# Altium schematic sheet YTN1-E608(Main)V1.4显示板..schdoc
size A3; SheetNumber: 0; SheetTotal: 0
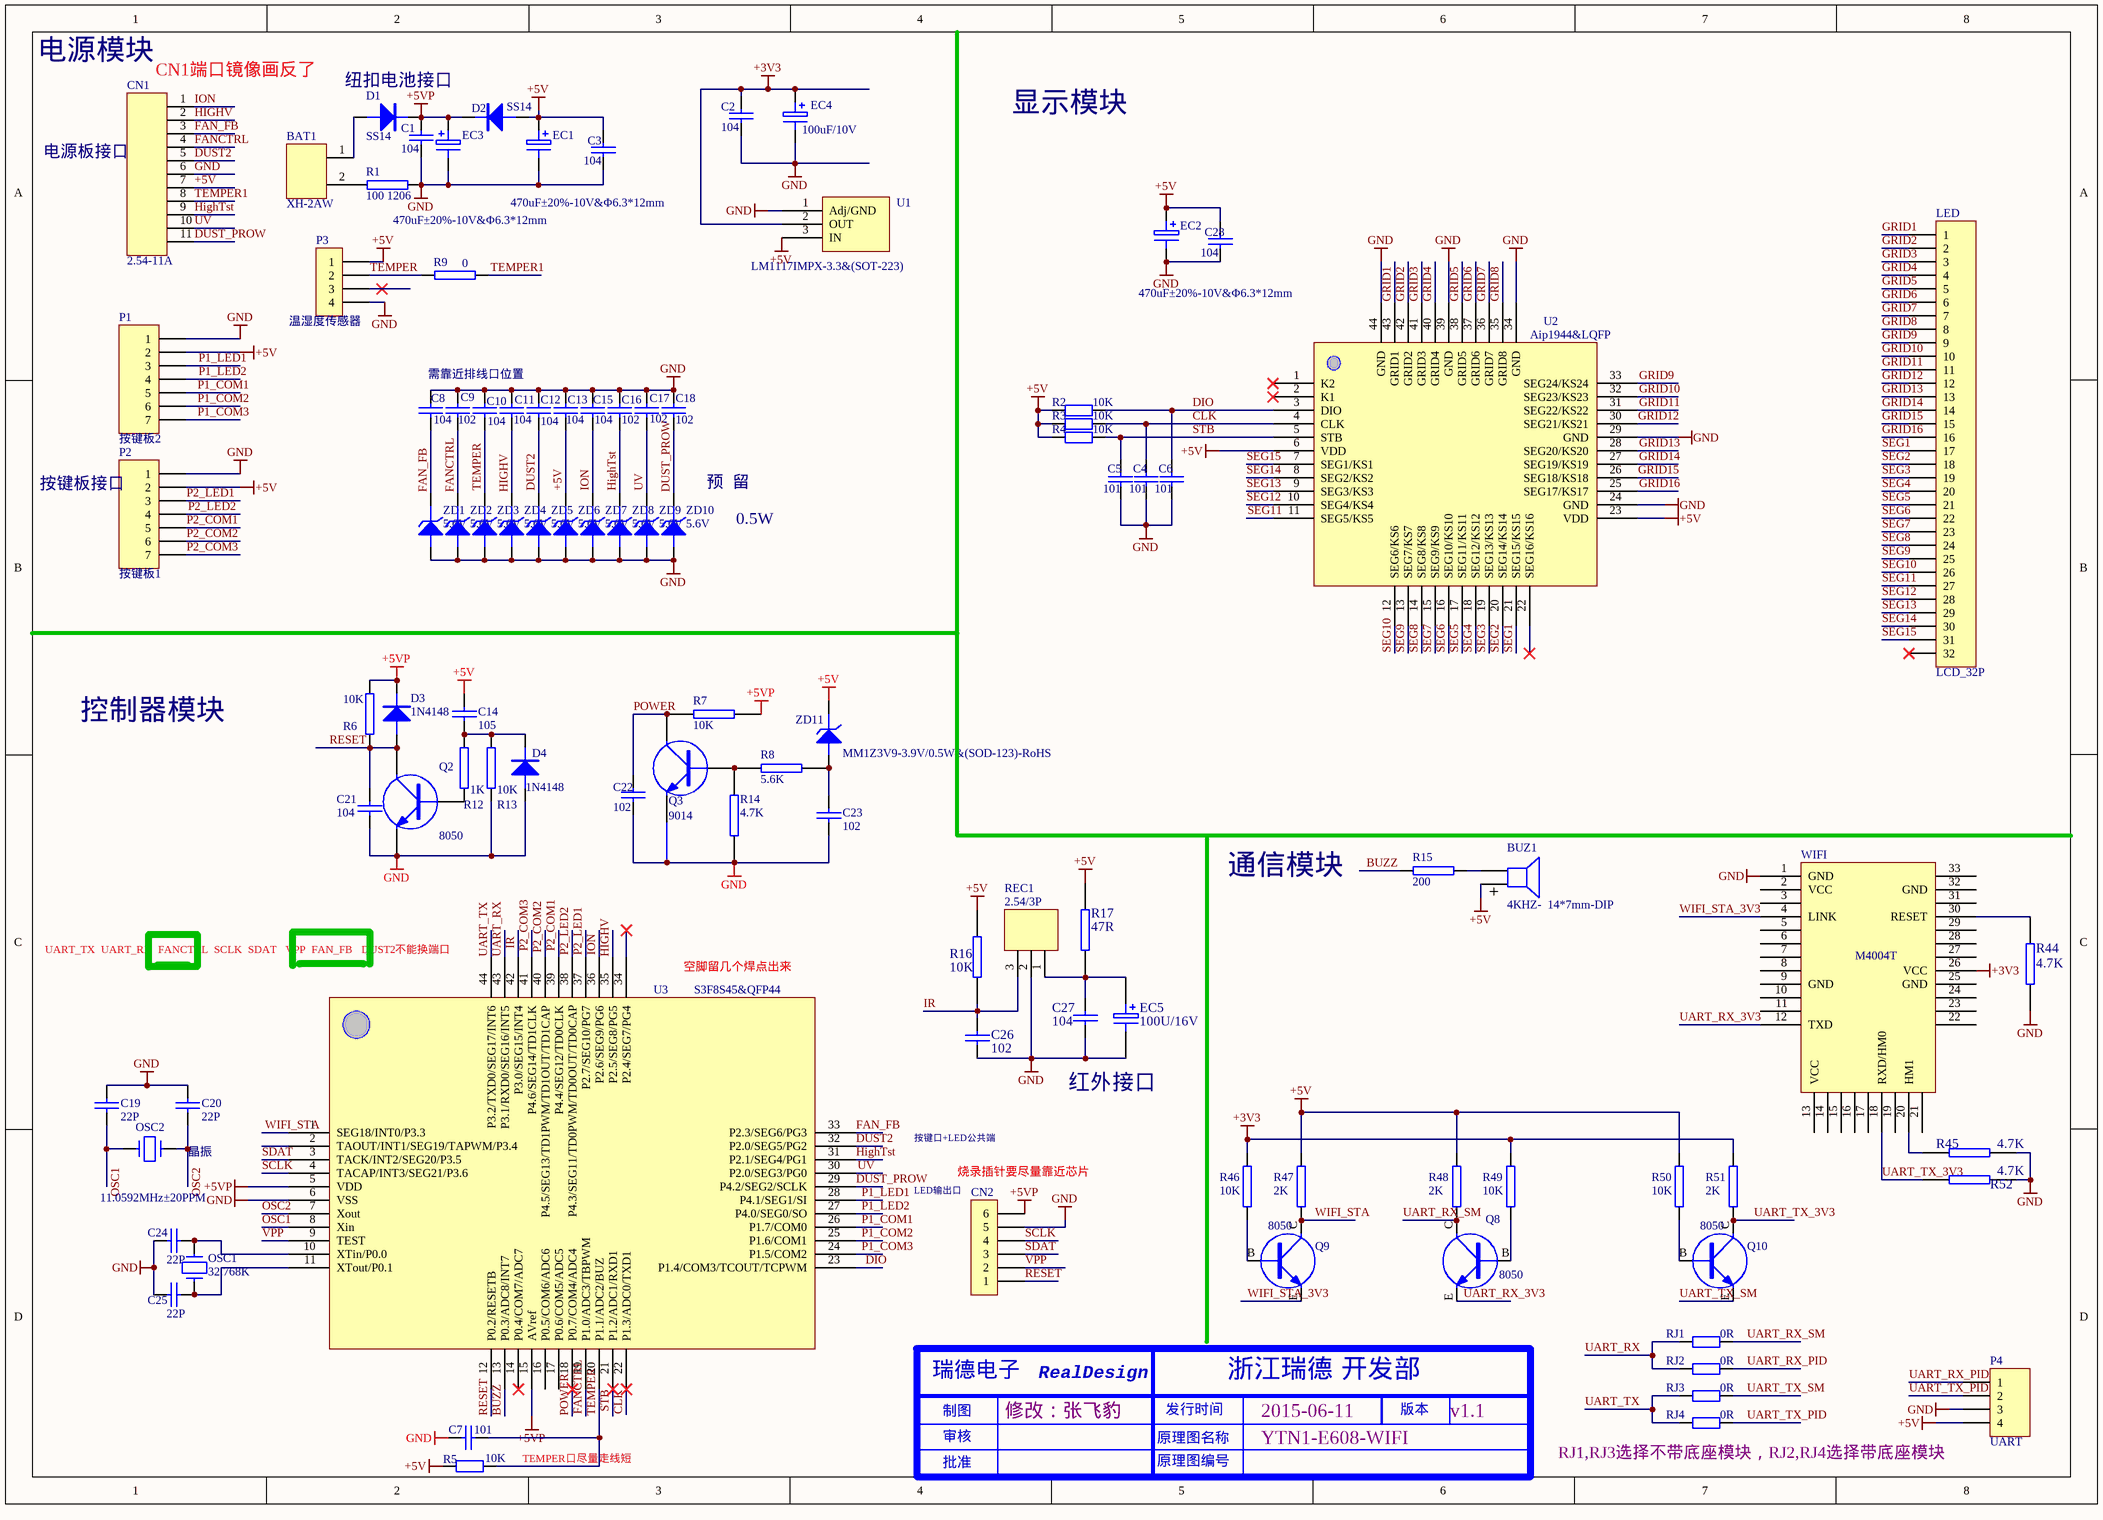
[diagram p0: YTN1-E608(Main)V1.4显示板..schdoc]

## Parts
BAT1  XH-2AW  [XH-2AW-1]
BUZ1  4KHZ-  14*7mm-DIP  [BUZ4K-BCE]
C1  104  [0805C]
C2  104  [0805C]
C3  104  [0805C]
C4  101  [0805C]
C5  101  [0805C]
C6  101  [0805C]
C7  101  [0805C]
C8  104  [0805C]
C9  102  [0805C]
C10  104  [0805C]
C11  104  [0805C]
C12  104  [0805C]
C13  104  [0805C]
C14  105  [0805C]
C15  104  [0805C]
C16  102  [0805C]
C17  102  [0805C]
C18  102  [0805C]
C19  22P  [0805C]
C20  22P  [0805C]
C21  104  [0805C]
C22  102  [0805C]
C23  102  [0805C]
C24  22P  [0805C]
C25  22P  [0805C]
C26  102  [0805C]
C27  104  [0805C]
C28  104  [0805C]
CN1  2.54-11A  [XH-11AW-1]
CN2  (no value)  [SIP-6P]
D1  SS14  [SMA]
D2  SS14  [SMA]
D3  1N4148  [SOD-123]
D4  1N4148  [SOD-123]
EC1  470uF±20%-10V&Φ6.3*12mm  [470UF10V-AI]
EC2  470uF±20%-10V&Φ6.3*12mm  [470UF10V-AI]
EC3  470uF±20%-10V&Φ6.3*12mm  [470UF10V-AI]
EC4  100uF/10V  [100UF10V-AI]
EC5  100U/16V  [100UF16V-AI]
LED  LCD_32P  [HYH]
OSC1  32.768K  [32.768J]
OSC2  11.0592MHz±20PPM  [CSA4.19MG]
P1  按键板2  [XH-7AW-1]
P2  按键板1  [XH-7AW-1]
P3  温湿度传感器  [XH-4AW-1]
P4  UART  [HDR1X4]
Q2  8050  [SOT-23-S]
Q3  9014  [SOT-23-S]
Q8  8050  [SOT-23-S]
Q9  8050  [SOT-23-S]
Q10  8050  [SOT-23-S]
R1  100 1206  [1206R]
R2  value 10K  [0805R]  (hidden comment: Res2)
R3  value 10K  [0805R]  (hidden comment: Res2)
R4  value 10K  [0805R]  (hidden comment: Res2)
R5  value 10K  [0805R]  (hidden comment: Res2)
R6  10K  [0805R]
R7  10K  [0805R]
R8  5.6K  [0805R]
R9  0  [0805R]
R12  1K  [0805R]
R13  10K  [0805R]
R14  4.7K  [0805R]
R15  200  [0805R]
R16  10K  [0805R]
R17  47R  [0805-1]
R44  4.7K  [0805R]
R45  4.7K  [0805R]
R46  10K  [0805R]
R47  2K  [0805R]
R48  2K  [0805R]
R49  10K  [0805R]
R50  10K  [0805R]
R51  2K  [0805R]
R52  4.7K  [0805R]
REC1  2.54/3P  [XH-3AW-1]
RJ1  0R  [AXIAL-0.4]
RJ2  0R  [AXIAL-0.4]
RJ3  0R  [AXIAL-0.4]
RJ4  0R  [AXIAL-0.4]
U1  LM1117IMPX-3.3&(SOT-223)
U2  Aip1944&LQFP  [QFP44]
U3  S3F8S45&QFP44  [QFP44]
WIFI  M4004T  [WIFI]
ZD1  5.6V  [SOD-123]
ZD2  5.6V  [SOD-123]
ZD3  5.6V  [SOD-123]
ZD4  5.6V  [SOD-123]
ZD5  5.6V  [SOD-123]
ZD6  5.6V  [SOD-123]
ZD7  5.6V  [SOD-123]
ZD8  5.6V  [SOD-123]
ZD9  5.6V  [SOD-123]
ZD10  5.6V  [SOD-123]
ZD11  MM1Z3V9-3.9V/0.5W&(SOD-123)-RoHS  [SOD-123]

## Nets
+3V3: C2.1 EC4.1 R46.1 R49.1 R51.1 U1.2(OUT) WIFI.26(VCC)
+5V: BUZ1.1 C3.1 C13.2 C14.1 C28.1 CN1.7 D2.A EC1.1 EC2.1 P1.2 P2.2 P3.1 P4.4 R2.2 R3.2 R4.1 R5.2 R16.2 R17.2 R47.1 R48.1 R50.1 U1.3(IN) U2.6(VDD) U2.23(VDD) ZD6.K ZD11.K
+5VP: C1.1 CN2.6 D1.K D2.K D3.K EC3.1 R6.2 R7.1 U3.5(VDD) U3.15(AVref)
GND: C1.2 C2.2 C3.2 C4.2 C5.2 C6.2 C7.2 C8.1 C9.1 C10.1 C11.1 C12.1 C13.1 C15.1 C16.1 C17.1 C18.1 C19.2 C20.2 C21.2 C22.2 C23.2 C24.1 C25.1 C26.2 C27.2 C28.2 CN1.6 CN2.5 D4.A EC1.2 EC2.2 EC3.2 EC4.2 EC5.2 P1.1 P2.1 P3.4 P4.3 Q2.E Q3.E R1.2 R13.1 R14.1 R44.2 R45.1 R52.1 REC1.2 U1.1(Adj/GND) U2.24(GND) U2.29(GND) U2.34(GND) U2.39(GND) U2.44(GND) U3.6(VSS) WIFI.1(GND) ZD1.A ZD2.A ZD3.A ZD4.A ZD5.A ZD6.A ZD7.A ZD8.A ZD9.A ZD10.A
BUZZ: R15.1 U3.13(P0.3/ADC8/INT7)
CLK: C4.1 R3.1 U2.4(CLK) U3.22(P1.3/ADC0/TXD1)
DIO: C6.1 R2.1 U2.3(DIO) U3.23(P1.4/COM3/TCOUT/TCPWM)
DUST2: C12.2 CN1.5 U3.32(P2.0/SEG5/PG2) ZD5.K
DUST_PROW: C18.2 CN1.11 U3.29(P4.2/SEG2/SCLK) ZD10.K
FAN_FB: C8.2 CN1.3 U3.33(P2.3/SEG6/PG3) ZD1.K
FANCTRL: C9.2 CN1.4 U3.19(P1.0/ADC3/TBPWM) ZD2.K
GRID1: LED.1 U2.43(GRID1)
GRID2: LED.2 U2.42(GRID2)
GRID3: LED.3 U2.41(GRID3)
GRID4: LED.4 U2.40(GRID4)
GRID5: LED.5 U2.38(GRID5)
GRID6: LED.6 U2.37(GRID6)
GRID7: LED.7 U2.36(GRID7)
GRID8: LED.8 U2.35(GRID8)
GRID9: LED.9 U2.33(SEG24/KS24)
GRID10: LED.10 U2.32(SEG23/KS23)
GRID11: LED.11 U2.31(SEG22/KS22)
GRID12: LED.12 U2.30(SEG21/KS21)
GRID13: LED.13 U2.28(SEG20/KS20)
GRID14: LED.14 U2.27(SEG19/KS19)
GRID15: LED.15 U2.26(SEG18/KS18)
GRID16: LED.16 U2.25(SEG17/KS17)
HighTst: C16.2 CN1.9 U3.31(P2.1/SEG4/PG1) ZD8.K
HIGHV: C11.2 CN1.2 U3.35(P2.5/SEG8/PG5) ZD4.K
ION: C15.2 CN1.1 U3.36(P2.6/SEG9/PG6) ZD7.K
IR: C26.1 R16.1 REC1.3 U3.42(P3.0/SEG15/INT4)
OSC1: C19.1 OSC2.1 U3.8(Xin)
OSC2: C20.1 OSC2.3 U3.7(Xout)
P1_COM1: P1.5 U3.26(P1.7/COM0)
P1_COM2: P1.6 U3.25(P1.6/COM1)
P1_COM3: P1.7 U3.24(P1.5/COM2)
P1_LED1: P1.3 U3.28(P4.1/SEG1/SI)
P1_LED2: P1.4 U3.27(P4.0/SEG0/SO)
P2_COM1: P2.5 U3.39(P4.4/SEG12/TD0CLK)
P2_COM2: P2.6 U3.40(P4.5/SEG13/TD1PWM/TD1OUT/TD1CAP)
P2_COM3: P2.7 U3.41(P4.6/SEG14/TD1CLK)
P2_LED1: P2.3 U3.37(P2.7/SEG10/PG7)
P2_LED2: P2.4 U3.38(P4.3/SEG11/TD0PWM/TD0OUT/TD0CAP)
POWER: C22.1 Q3.C R7.2 U3.18(P0.7/COM4/ADC4)
RESET: C21.1 CN2.1 D3.A Q2.C R6.1 U3.12(P0.2/RESETB)
SCLK: CN2.4 U3.4(TACAP/INT3/SEG21/P3.6)
SDAT: CN2.3 U3.3(TACK/INT2/SEG20/P3.5)
SEG1: LED.17 U2.21(SEG15/KS15)
SEG2: LED.18 U2.20(SEG14/KS14)
SEG3: LED.19 U2.19(SEG13/KS13)
SEG4: LED.20 U2.18(SEG12/KS12)
SEG5: LED.21 U2.17(SEG11/KS11)
SEG6: LED.22 U2.16(SEG10/KS10)
SEG7: LED.23 U2.15(SEG9/KS9)
SEG8: LED.24 U2.14(SEG8/KS8)
SEG9: LED.25 U2.13(SEG7/KS7)
SEG10: LED.26 U2.12(SEG6/KS6)
SEG11: LED.27 U2.11(SEG5/KS5)
SEG12: LED.28 U2.10(SEG4/KS4)
SEG13: LED.29 U2.9(SEG3/KS3)
SEG14: LED.30 U2.8(SEG2/KS2)
SEG15: LED.31 U2.7(SEG1/KS1)
STB: C5.1 R4.2 U2.5(STB) U3.21(P1.2/ADC1/RXD1)
TEMPER: C7.1 C10.2 P3.2 R5.1 R9.1 U3.20(P1.1/ADC2/BUZ) ZD3.K
TEMPER1: CN1.8 R9.2
UART_RX: RJ1.1 RJ2.1 U3.43(P3.1/RXD0/SEG16/INT5)
UART_RX_3V3: Q8.E WIFI.12(TXD)
UART_RX_PID: P4.1 RJ2.2
UART_RX_SM: Q8.C R48.2 RJ1.2
UART_TX: RJ3.1 RJ4.1 U3.44(P3.2/TXD0/SEG17/INT6)
UART_TX_3V3: Q10.C R51.2 R52.2 WIFI.18(RXD/HM0)
UART_TX_PID: P4.2 RJ4.2
UART_TX_SM: Q10.E RJ3.2
UV: C17.2 CN1.10 U3.30(P2.0/SEG3/PG0) ZD9.K
VPP: CN2.2 U3.9(TEST)
WIFI_STA: Q9.C R47.2 U3.1(SEG18/INT0/P3.3)
WIFI_STA_3V3: Q9.E WIFI.4(LINK)
NetBAT1_1: BAT1.1 D1.A
NetBAT1_2: BAT1.2 R1.1
NetBUZ1_2: BUZ1.2 R15.2
NetC14_2: C14.2 D4.K R12.2 R13.2
NetC23_1: C23.1 R8.1 ZD11.A
NetC24_2: C24.2 OSC1.2 U3.10(XTin/P0.0)
NetC25_2: C25.2 OSC1.1 U3.11(XTout/P0.1)
NetC27_1: C27.1 EC5.1 R17.1 REC1.1
NetQ2_B: Q2.B R12.1
NetQ3_B: Q3.B R8.2 R14.2
NetQ8_B: Q8.B R49.2
NetQ9_B: Q9.B R46.2
NetQ10_B: Q10.B R50.2
NetR44_1: R44.1 WIFI.30(RESET)
NetR45_2: R45.2 WIFI.20(HM1)

Not connected (* = marked no-connect by the designer): LED 32*; P3 3*; U2 1(K2)* 2(K1)* 22(SEG16/KS16)*; U3 2(TAOUT/INT1/SEG19/TAPWM/P3.4) 14(P0.4/COM7/ADC7)* 16(P0.5/COM6/ADC6) 17(P0.6/COM5/ADC5) 34(P2.4/SEG7/PG4)*; WIFI 2(VCC) 3 5 6 7 8 9(GND) 10 11 13(VCC) 14 15 16 17 19 21 22 23 24 25(GND) 27 28 29 31 32(GND) 33

## Notes on the sheet
- 电源模块
- (near CN1) CN1端口镜像画反了
- (near D1) 纽扣电池接口
- 电源板接口
- 显示模块
- 需靠近排线口位置
- 按键板接口
- (near ZD10) 预  留
- 0.5W
- 控制器模块
- 通信模块
- (near BUZ1) +
- (near U3) UART_TX  UART_RX  FANCTRL  SCLK  SDAT   VPP  FAN_FB   DUST2不能换端口
- (near U3) 空脚留几个焊点出来
- 红外接口
- 晶振
- 按键口+LED公共端
- LED输出口
- (near CN2) 烧录插针要尽量靠近芯片
- (near U3) 数码屏驱动口
- TEMPER口尽量走线短
- 修改：张飞豹
- 2015-06-11
- YTN1-E608-WIFI
- v1.1
- (near RJ4) RJ1,RJ3选择不带底座模块，RJ2,RJ4选择带底座模块
- 瑞德电子
- RealDesign
- 浙江瑞德 开发部
- 制图
- 审核
- 原理图名称
- 发行时间
- 版本
- 批准
- 原理图编号

## Library data of the parts
BAT1 = 250-2A
BUZ1 = SPEAKER
C1-C3 C24 C25 C28 = CAP
C4-C23 = CAP: 瓷片电容、独石电容
C26 C27 = CAP: Capacitor
CN1 = 3.96-11A
CN2 = CON6: Connector
D1-D4 = DIODE: 整流二极管、开关二极管、肖特基二极管、快恢复二极管
EC1 EC2 = ELECTRO: 电解电容正极为"1"号脚
EC3 EC4 = ELECTRO1
EC5 = ELECTRO1: Electrolytic Capacitor
OSC1 OSC2 = CRYSTAL
P1 P2 = Header 7: Header, 7-Pin; LatestRevisionDate: 17-Jul-2002; LatestRevisionNote: Re-released for DXP Platform.; Publisher: Altium Limited
P3 = CON4: Connector
P4 = Header 4: Header, 4-Pin; LatestRevisionDate: 17-Jul-2002; LatestRevisionNote: Re-released for DXP Platform.; Publisher: Altium Limited
Q2 Q3 = NPN: 晶体管
Q8-Q10 = NPN: NPN Transistor
R1 R6 R9 R12 R13 R15-R17 R44-R52 = RES2
R2-R5 = Res2: Resistor; Published: 8-Jun-2000; LatestRevisionDate: 17-Jul-2002; LatestRevisionNote: Re-released for DXP Platform.; PackageReference: AXIAL-0.4; Publisher: Altium Limited; PackageDescription: Axial Device, Thru-Hole; 2 Leads; 0.4 in Pin Spacing
R7 R8 R14 = R
REC1 = 3.96-3A
RJ1-RJ4 = Res2: Resistor; Value: 1K; Published: 8-Jun-2000; LatestRevisionDate: 17-Jul-2002; LatestRevisionNote: Re-released for DXP Platform.; PackageReference: AXIAL-0.4; Publisher: Altium Limited
U1 = LM1117-3.3V
WIFI = WIFI
ZD1-ZD11 = ZD